# EAGLE design Qwiic_Multi_Port_Board (EAGLE 9.6.2)
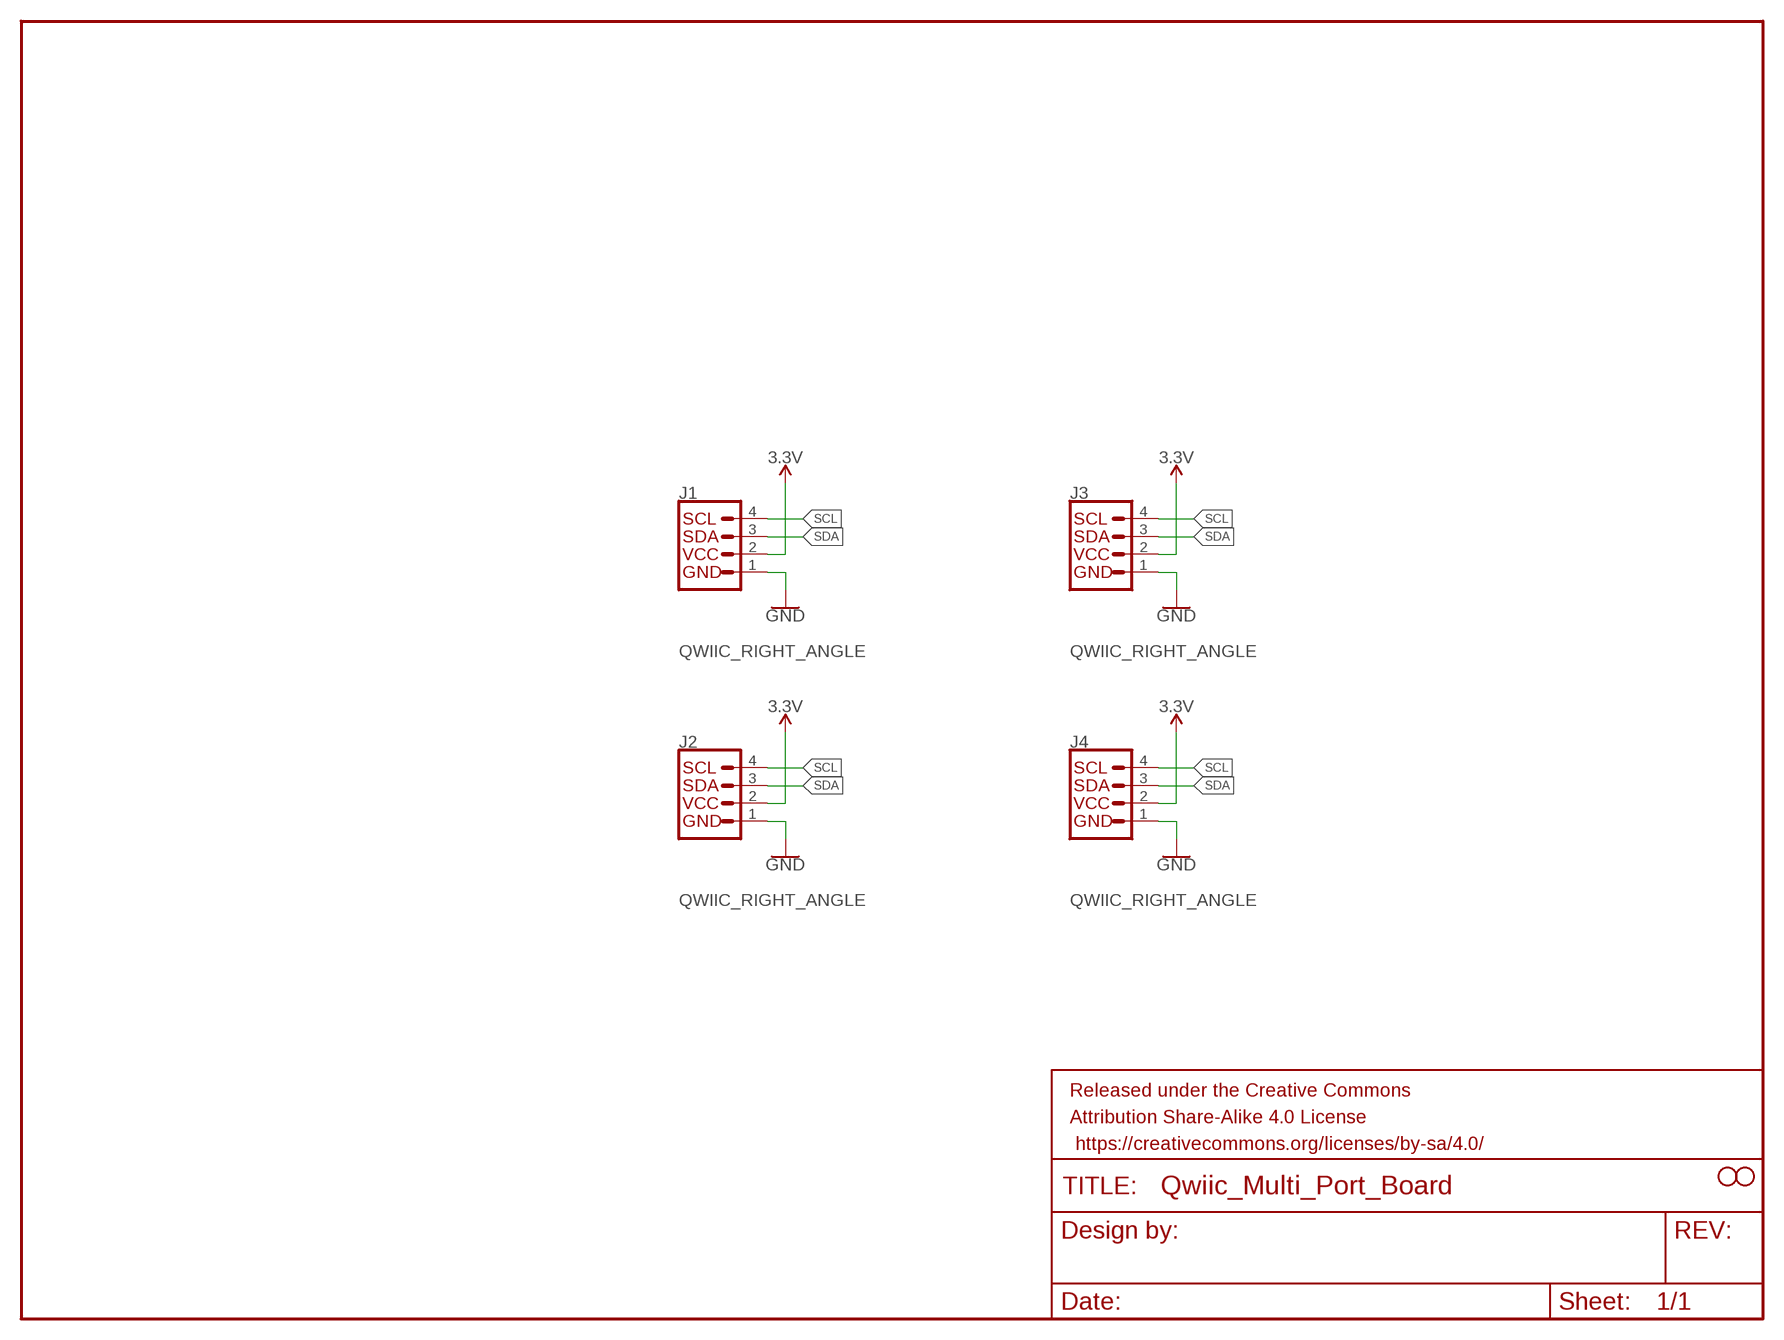
[diagram p0: schematic, sheet 1]

## Parts
FRAME1  FRAME-LETTER  [CREATIVE_COMMONS]
H1  STAND-OFFTIGHT  [STAND-OFF-TIGHT]
H2  STAND-OFFTIGHT  [STAND-OFF-TIGHT]
J1  QWIIC_RIGHT_ANGLE  QWIIC_CONNECTORJS-1MM  [JST04_1MM_RA]
J2  QWIIC_RIGHT_ANGLE  QWIIC_CONNECTORJS-1MM  [JST04_1MM_RA]
J3  QWIIC_RIGHT_ANGLE  QWIIC_CONNECTORJS-1MM  [JST04_1MM_RA]
J4  QWIIC_RIGHT_ANGLE  QWIIC_CONNECTORJS-1MM  [JST04_1MM_RA]

## Nets
3.3V: J1.2 J2.2 J3.2 J4.2
GND: J1.1 J2.1 J3.1 J4.1
SCL: J1.4 J2.4 J3.4 J4.4
SDA: J1.3 J2.3 J3.3 J4.3

## Library data of the parts
FRAME1 = SparkFun-Aesthetics:FRAME-LETTER: Schematic Frame - Letter Standard 8.5x11 US Letter frame
H1 H2 = SparkFun-Hardware:STAND-OFF: Stand Off Drill holes for mechanically mounting via screws, standoffs, etc. Note: Use the keepout ring to avoid running the screw head into surrounding components. Variant Overviews STAND-OFF - Mechanical footprint for a #4 phillips button head screw. STAND-OFF-TIGHT - Mechanical footprint for a #4 phillips button head screw, Example SparkFun Products Screw - Phillips Head (1/4", 4-40, 10 pack) <https://www.sparkfun.com/products/10453> (PRT-10453) Screw - Phillips Head (1/2", 4-40, 10 pack) <https://www.sparkfun.com/products/10452> (PRT-10452) Screw - Phillips Head (3/4", 4-40, 10 pack) <https://www.sparkfun.com/products/10451> (PRT-10451) Screw - Phillips Head (1", 4-40, 10 pack) <https://www.sparkfun.com/products/10450> (PRT-10450)
J1-J4 = SparkFun-Connectors:QWIIC_CONNECTOR: SparkFun I2C Standard Qwiic Connector An SMD 1mm pitch JST connector makes it easy and quick (get it? Qwiic?) to connect I2C devices to each other. The Qwiic system <http://www.sparkfun.com/qwiic> enables fast and solderless connection between popular platforms and various sensors and actuators. We carry 200mm <https://www.sparkfun.com/products/14204>, 100mm <https://www.sparkfun.com/products/14205>, 50mm <https://www.sparkfun.com/products/14206>, and breadboard friendly <https://www.sparkfun.com/products/14207> Qwiic cables. We also offer 10 pcs strips <https://www.sparkfun.com/products/14323> the SMD connectors.; PROD_ID: CONN-13694

## Board
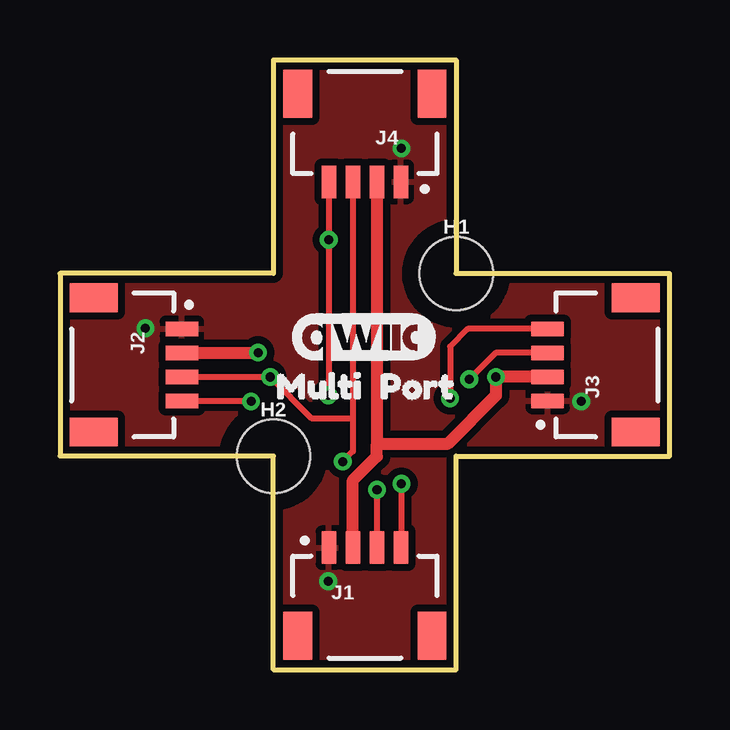
[diagram p1: board, top side]
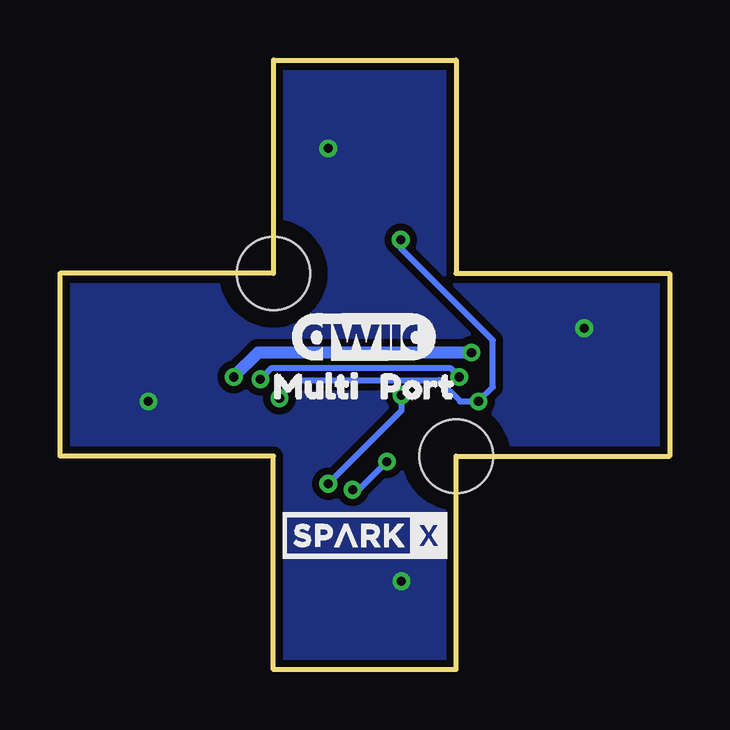
[diagram p2: board, bottom side, seen from below]

Size 25.4 x 25.4 mm. Coordinates in mm from the lower left corner, seen from the top.
Outline: 8.89,0 16.51,0 16.51,8.89 25.4,8.89 25.4,16.51 16.51,16.51 16.51,25.4 8.89,25.4 8.89,16.51 0,16.51 0,8.89 8.89,8.89 8.89,0
Copper layers (1*16): Top 0.035mm / dielectric 1.5mm / Bottom 0.035mm
Design rules "SparkFun-2-layer-TIGHT": minimum track width 7mil, minimum drill 15mil, track to track 7mil, track to pad 7mil, pad to pad 7mil, via to via 7mil, smd to smd 7mil, copper to edge 7mil, drill to drill 7mil, minimum pad ring 7mil, minimum via ring 7mil, stop-mask expansion 4mil, vias tented up to drill 25mil, thermal gap 10mil

### Footprints (pad centres in the part's own frame; a part is rotated, then mirrored left to right if it is on the bottom)
STAND-OFF-TIGHT = hole 3.048: 0,0
JST04_1MM_RA = smd 0.6 x 1.35: 1 -1.5,0; 2 -0.5,0; 3 0.5,0; 4 1.5,0 | smd 1.2 x 2: NC1 2.8,-3.675; NC2 -2.8,-3.675

### Placement (x,y rotation side)
FRAME1  21.59,-8.89 0 top  (outside the outline)
H1  16.51,16.51 0 top
H2  8.89,8.89 0 top
J1  12.7,5.08 0 top
J2  5.08,12.7 270 top
J3  20.32,12.7 90 top
J4  12.7,20.32 180 top
U$1  [QWIIC_6MM]  12.7,13.84 0 top
U$2  [SPARKX-SMALL]  12.7,5.59 0 bottom
U$3  [QWIIC_6MM]  12.7,13.84 0 bottom
U$4  [MULTI1]  8.13,11.81 0 top
U$5  [PORT2]  12.45,11.81 0 top
U$7  [MULTI1]  17.4,11.81 0 bottom
U$8  [PORT2]  12.95,11.81 0 bottom

### Tracks (layer width: path | path; a pad name or v marks a point on that pad's centre or on a via)
3.3V  (via drill 0.38)
  Top 0.254: 8.25,13.2 v8.26,13.21 | v18.17,12.2 v18.16,12.19
  Top 0.508: v18.16,12.19 18.16,11.43 16.13,9.4 13.2,9.4 | J2.2 8.25,13.2 | J4.2 13.2,9.4 | 13.2,9.4 13.2,8.88 12.2,7.88 J1.2 | J3.2 v18.17,12.2
  Bottom 0.508: v8.26,13.21 17.14,13.21 v18.16,12.19
GND  (via drill 0.38)
  other vias: 11.18,3.68 3.56,14.22 14.22,21.72 21.72,11.18
  pour Top (isolate 0.305): 0,16.51 0,8.89 8.89,8.89 8.89,0 16.51,0 16.51,8.89 25.4,8.89 25.4,16.51 16.51,16.51 16.51,25.4 8.89,25.4 8.89,16.51
  pour Bottom (isolate 0.305): 0,16.51 0,8.89 8.89,8.89 8.89,0 16.51,0 16.51,8.89 25.4,8.89 25.4,16.51 16.51,16.51 16.51,25.4 8.89,25.4 8.89,16.51
SCL  (via drill 0.38)
  Top 0.254: v16.26,11.3 16.26,13.46 16.99,14.2 J3.4 | J4.4 v11.2,17.91 11.2,11.45 v11.18,11.43 | v14.22,7.75 14.22,5.1 J1.4 | J2.4 7.94,11.2 v7.96,11.18
  Bottom 0.254: v11.18,11.43 11.18,10.79 v14.22,7.75 | v11.2,17.91 11.2,17.55 7.37,13.72 7.37,11.77 v7.96,11.18 8.72,11.18 9.61,12.06 15.49,12.06 v16.26,11.3
SDA  (via drill 0.38)
  Top 0.254: v13.21,7.49 J1.3 | J2.3 v8.76,12.2 v8.76,12.19 10.48,10.48 12.14,10.48 12.2,10.41 | J4.3 12.2,10.41 | 12.2,10.41 12.2,9.09 v11.78,8.67 | J3.3 18.15,13.2 v17.05,12.1
  Bottom 0.254: v8.76,12.19 9.14,12.57 16.57,12.57 v17.05,12.1 | v11.78,8.67 12.95,7.49 v13.21,7.49